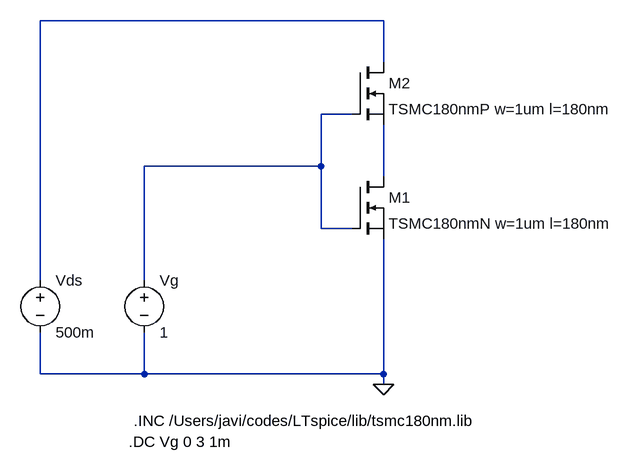
[diagram p0: schematic cmos.asc]
cmos.asc, the LTspice schematic file:
Version 4
SHEET 1 1216 808
WIRE 336 112 -192 112
WIRE 336 176 336 112
WIRE 288 256 240 256
WIRE 240 336 240 256
WIRE 240 336 -32 336
WIRE 336 352 336 272
WIRE 240 432 240 336
WIRE 288 432 240 432
WIRE -192 512 -192 112
WIRE -32 512 -32 336
WIRE -192 656 -192 592
WIRE -32 656 -32 592
WIRE -32 656 -192 656
WIRE 336 656 336 448
WIRE 336 656 -32 656
WIRE 336 672 336 656
FLAG 336 672 0
SYMBOL voltage -192 496 R0
SYMATTR InstName Vds
SYMATTR Value 500m
SYMBOL voltage -32 496 R0
SYMATTR InstName Vg
SYMATTR Value 1
SYMBOL nmos 288 176 R0
SYMATTR InstName M2
SYMATTR Value TSMC180nmP w=1um l=180nm
SYMBOL nmos 288 352 R0
SYMATTR InstName M1
SYMATTR Value TSMC180nmN w=1um l=180nm
TEXT -48 728 Left 2 !.INC /Users/javi/codes/LTspice/lib/tsmc180nm.lib
TEXT -56 760 Left 2 !.DC Vg 0 3 1m

The netlist it stands for:
* cmos.asc
Vds N001 0 500m
Vg N002 0 1
M2 N001 N002 N003 N003 TSMC180nmP w=1um l=180nm
M1 N003 N002 0 0 TSMC180nmN w=1um l=180nm
.model NMOS NMOS
.model PMOS PMOS
.lib standard.mos
.INC /Users/javi/codes/LTspice/lib/tsmc180nm.lib
.DC Vg 0 3 1m
.backanno
.end